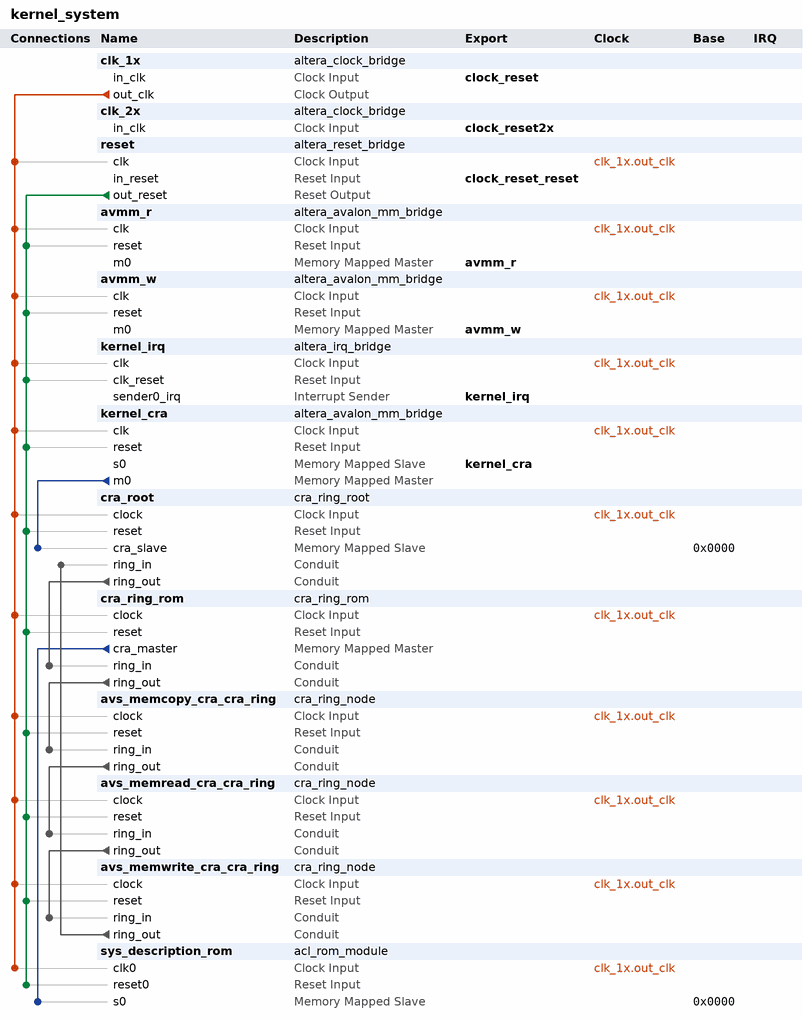
[diagram p0: system contents]
# Platform Designer (Qsys) system kernel_system, Arria 10 10AX115N3F40E2SG
# Parameters at their usual value, and those the tool derives, are not listed.
package require -exact qsys 1.0
create_system kernel_system
set_project_property DEVICE_FAMILY {Arria 10}
set_project_property DEVICE 10AX115N3F40E2SG

add_component clk_1x ip/kernel_system/kernel_system_clk_1x.ip altera_clock_bridge clk_1x 17.0
load_component clk_1x
set_component_parameter_value DERIVED_CLOCK_RATE 0
set_component_parameter_value EXPLICIT_CLOCK_RATE 0
save_component

add_component clk_2x ip/kernel_system/kernel_system_clk_2x.ip altera_clock_bridge clk_2x 17.0
load_component clk_2x
set_component_parameter_value DERIVED_CLOCK_RATE 0
set_component_parameter_value EXPLICIT_CLOCK_RATE 0
save_component

add_component reset ip/kernel_system/kernel_system_reset.ip altera_reset_bridge reset 17.0

add_component avmm_r ip/kernel_system/kernel_system_avmm_r.ip altera_avalon_mm_bridge avmm_r 17.0
load_component avmm_r
set_component_parameter_value DATA_WIDTH 512
set_component_parameter_value ADDRESS_WIDTH 48
set_component_parameter_value USE_AUTO_ADDRESS_WIDTH 0
set_component_parameter_value ADDRESS_UNITS SYMBOLS
set_component_parameter_value MAX_BURST_SIZE 16
set_component_parameter_value MAX_PENDING_RESPONSES 64
save_component

add_component avmm_w ip/kernel_system/kernel_system_avmm_w.ip altera_avalon_mm_bridge avmm_w 17.0
load_component avmm_w
set_component_parameter_value DATA_WIDTH 512
set_component_parameter_value ADDRESS_WIDTH 48
set_component_parameter_value USE_AUTO_ADDRESS_WIDTH 0
set_component_parameter_value ADDRESS_UNITS SYMBOLS
set_component_parameter_value MAX_BURST_SIZE 16
set_component_parameter_value MAX_PENDING_RESPONSES 64
save_component

add_component kernel_irq ip/kernel_system/kernel_system_kernel_irq.ip altera_irq_bridge kernel_irq 17.0

add_component kernel_cra ip/kernel_system/kernel_system_kernel_cra.ip altera_avalon_mm_bridge kernel_cra 17.0

add_component cra_root ip/kernel_system/kernel_system_cra_root.ip cra_ring_root cra_root 1.0

add_component cra_ring_rom ip/kernel_system/kernel_system_cra_ring_rom.ip cra_ring_rom cra_ring_rom 1.0
load_component cra_ring_rom
set_component_parameter_value RING_ADDR_W 4
set_component_parameter_value DATA_W 64
set_component_parameter_value ID_W 2
set_component_parameter_value ROM_W 5
set_component_parameter_value ROM_EXT_W 0
save_component

add_component avs_memcopy_cra_cra_ring ip/kernel_system/kernel_system_avs_memcopy_cra_cra_ring.ip cra_ring_node avs_memcopy_cra_cra_ring 1.0
load_component avs_memcopy_cra_cra_ring
set_component_parameter_value RING_ADDR_W 4
set_component_parameter_value CRA_ADDR_W 4
set_component_parameter_value DATA_W 64
set_component_parameter_value ID_W 2
set_component_parameter_value ID 0
save_component

add_component avs_memread_cra_cra_ring ip/kernel_system/kernel_system_avs_memread_cra_cra_ring.ip cra_ring_node avs_memread_cra_cra_ring 1.0

add_component avs_memwrite_cra_cra_ring ip/kernel_system/kernel_system_avs_memwrite_cra_cra_ring.ip cra_ring_node avs_memwrite_cra_cra_ring 1.0

add_component sys_description_rom ip/kernel_system/kernel_system_sys_description_rom.ip acl_rom_module sys_description_rom 1.0

# connections
add_connection clk_1x.out_clk avmm_r.clk clock
add_connection clk_1x.out_clk avmm_w.clk clock
add_connection clk_1x.out_clk avs_memcopy_cra_cra_ring.clock clock
add_connection clk_1x.out_clk avs_memread_cra_cra_ring.clock clock
add_connection clk_1x.out_clk avs_memwrite_cra_cra_ring.clock clock
add_connection clk_1x.out_clk cra_ring_rom.clock clock
add_connection clk_1x.out_clk cra_root.clock clock
add_connection clk_1x.out_clk kernel_cra.clk clock
add_connection clk_1x.out_clk kernel_irq.clk clock
add_connection clk_1x.out_clk reset.clk clock
add_connection clk_1x.out_clk sys_description_rom.clk0 clock
add_connection reset.out_reset avmm_r.reset reset
add_connection reset.out_reset avmm_w.reset reset
add_connection reset.out_reset avs_memcopy_cra_cra_ring.reset reset
add_connection reset.out_reset avs_memread_cra_cra_ring.reset reset
add_connection reset.out_reset avs_memwrite_cra_cra_ring.reset reset
add_connection reset.out_reset cra_ring_rom.reset reset
add_connection reset.out_reset cra_root.reset reset
add_connection reset.out_reset kernel_cra.reset reset
add_connection reset.out_reset kernel_irq.clk_reset reset
add_connection reset.out_reset sys_description_rom.reset0 reset
add_connection cra_ring_rom.cra_master sys_description_rom.s0 avalon
set_connection_parameter_value cra_ring_rom.cra_master/sys_description_rom.s0 baseAddress 0x0000
add_connection kernel_cra.m0 cra_root.cra_slave avalon
set_connection_parameter_value kernel_cra.m0/cra_root.cra_slave baseAddress 0x0000
add_connection avs_memcopy_cra_cra_ring.ring_out avs_memread_cra_cra_ring.ring_in conduit
add_connection avs_memread_cra_cra_ring.ring_out avs_memwrite_cra_cra_ring.ring_in conduit
add_connection avs_memwrite_cra_cra_ring.ring_out cra_root.ring_in conduit
add_connection cra_ring_rom.ring_out avs_memcopy_cra_cra_ring.ring_in conduit
add_connection cra_root.ring_out cra_ring_rom.ring_in conduit

# exported interfaces
add_interface avmm_r avalon master
set_interface_property avmm_r EXPORT_OF avmm_r.m0
add_interface avmm_w avalon master
set_interface_property avmm_w EXPORT_OF avmm_w.m0
add_interface clock_reset clock sink
set_interface_property clock_reset EXPORT_OF clk_1x.in_clk
add_interface clock_reset2x clock sink
set_interface_property clock_reset2x EXPORT_OF clk_2x.in_clk
add_interface clock_reset_reset reset sink
set_interface_property clock_reset_reset EXPORT_OF reset.in_reset
add_interface kernel_cra avalon slave
set_interface_property kernel_cra EXPORT_OF kernel_cra.s0
add_interface kernel_irq interrupt sender
set_interface_property kernel_irq EXPORT_OF kernel_irq.sender0_irq

set_interconnect_requirement {$system} qsys_mm.clockCrossingAdapter HANDSHAKE
set_interconnect_requirement {$system} qsys_mm.maxAdditionalLatency 0

save_system kernel_system.qsys
